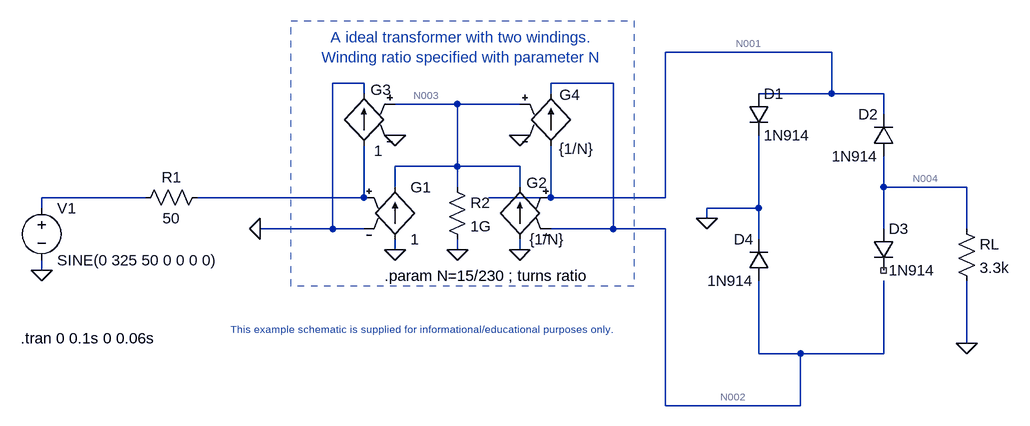
[diagram p0: schematic Full_wave_Rectifier.asc]
Full_wave_Rectifier.asc, the LTspice schematic file:
Version 4
SHEET 1 1160 680
WIRE 880 -192 624 -192
WIRE 160 -144 112 -144
WIRE 544 -144 448 -144
WIRE 160 -128 160 -144
WIRE 448 -128 448 -144
WIRE 880 -128 880 -192
WIRE 880 -128 768 -128
WIRE 960 -128 880 -128
WIRE 304 -112 208 -112
WIRE 400 -112 304 -112
WIRE 960 -96 960 -128
WIRE 304 -16 304 -112
WIRE 304 -16 208 -16
WIRE 400 -16 304 -16
WIRE 208 16 208 -16
WIRE 304 16 304 -16
WIRE 400 16 400 -16
WIRE 960 16 960 -32
WIRE 1088 16 960 16
WIRE -176 32 -336 32
WIRE 160 32 160 -48
WIRE 160 32 -96 32
WIRE 448 32 448 -48
WIRE 448 32 352 32
WIRE 624 32 624 -192
WIRE 624 32 448 32
WIRE -336 48 -336 32
WIRE 768 48 768 -64
WIRE 768 48 688 48
WIRE 688 64 688 48
WIRE 112 80 112 -144
WIRE 112 80 0 80
WIRE 160 80 112 80
WIRE 544 80 544 -144
WIRE 544 80 448 80
WIRE 624 80 544 80
WIRE 960 80 960 16
WIRE 1088 80 1088 16
WIRE 768 96 768 48
WIRE 208 112 208 96
WIRE 304 112 304 96
WIRE 400 112 400 96
WIRE -336 144 -336 128
WIRE 1088 256 1088 160
WIRE 768 272 768 160
WIRE 832 272 768 272
WIRE 960 272 960 160
WIRE 960 272 832 272
WIRE 624 352 624 80
WIRE 832 352 832 272
WIRE 832 352 624 352
FLAG -336 144 0
FLAG 400 112 0
FLAG 208 112 0
FLAG 208 -64 0
FLAG 400 -64 0
FLAG 304 112 0
FLAG 0 80 0
FLAG 688 64 0
FLAG 1088 256 0
SYMBOL voltage -336 32 R0
WINDOW 123 0 0 Left 0
WINDOW 39 0 0 Left 0
SYMATTR InstName V1
SYMATTR Value SINE(0 325 50 0 0 0 0)
SYMBOL res -80 16 R90
WINDOW 0 0 56 VBottom 2
WINDOW 3 32 56 VTop 2
SYMATTR InstName R1
SYMATTR Value 50
SYMBOL g 208 0 R0
SYMATTR InstName G1
SYMATTR Value 1
SYMBOL g 400 0 M0
WINDOW 0 -10 9 Right 2
WINDOW 3 -15 96 Right 2
SYMATTR InstName G2
SYMATTR Value {1/N}
SYMBOL g 160 -144 M0
WINDOW 0 -10 10 Right 2
WINDOW 3 -16 104 Right 2
SYMATTR InstName G3
SYMATTR Value 1
SYMBOL g 448 -144 R0
WINDOW 0 13 18 Left 2
WINDOW 3 12 101 Left 2
SYMATTR InstName G4
SYMATTR Value {1/N}
SYMBOL res 288 0 R0
SYMATTR InstName R2
SYMATTR Value 1G
SYMBOL diode 752 -128 R0
SYMATTR InstName D1
SYMATTR Value 1N914
SYMBOL diode 976 -32 R180
WINDOW 0 24 64 Left 2
WINDOW 3 24 0 Left 2
SYMATTR InstName D2
SYMATTR Value 1N914
SYMBOL diode 944 80 R0
SYMATTR InstName D3
SYMATTR Value 1N914
SYMBOL diode 784 160 R180
WINDOW 0 24 64 Left 2
WINDOW 3 24 0 Left 2
SYMATTR InstName D4
SYMATTR Value 1N914
SYMBOL res 1072 64 R0
SYMATTR InstName RL
SYMATTR Value 3.3k
TEXT 240 224 Top 1 ;This example schematic is supplied for informational/educational purposes only.
TEXT 312 -168 Bottom 2 ;A ideal transformer with two windings.\nWinding ratio specified with parameter N
TEXT 192 152 Left 2 !.param N=15/230 ; turns ratio
TEXT -368 248 Left 2 !.tran 0 0.1s 0 0.06s
RECTANGLE Normal 576 168 48 -240 2

The netlist it stands for:
* Full_wave_Rectifier.asc
V1 N005 0 SINE(0 325 50 0 0 0 0)
R1 N006 N005 50
G1 0 N003 N006 0 1
G2 0 N003 N001 N002 {1/N}
G3 N006 0 N003 0 1
G4 N001 N002 N003 0 {1/N}
R2 N003 0 1G
D1 N001 0 1N914
D2 N004 N001 1N914
D3 N004 NC_01 1N914
D4 N002 0 1N914
RL N004 0 3.3k
.model D D
.lib standard.dio
* This example schematic is supplied for informational/educational purposes only.
* A ideal transformer with two windings.
* Winding ratio specified with parameter N
.param N=15/230 ; turns ratio
.tran 0 0.1s 0 0.06s
.backanno
.end

* Results of the author's LTspice run, read from the files saved beside the schematic
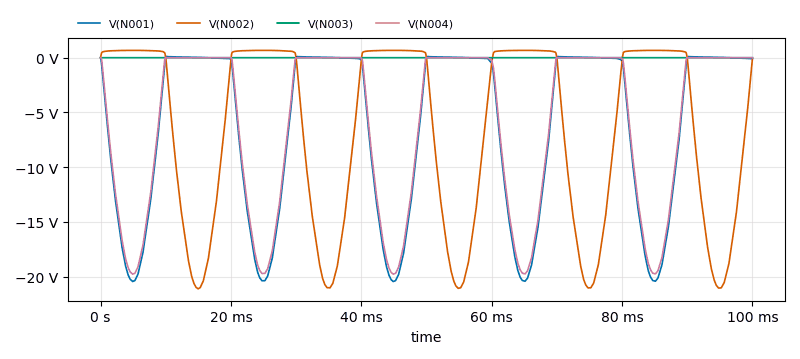
[diagram p1: Transient Analysis of Full_wave_Rectifier.asc, plotted from the saved traces]
* Transient Analysis, 1 run:
*   V(N001): min -20.45 V, max 102.6 mV, average -6.3 V, rms 10.05 V, last -92.69 mV
*   V(N002): min -21.12 V, max 668.7 mV, average -6.27 V, rms 10.46 V, last -92.69 mV
*   V(N003): min -1.586 nV, max 391 µV, average 118.5 µV, rms 190.6 µV, last 1.539 nV
*   V(N004): min -19.78 V, max 27.73 µV, average -5.996 V, rms 9.642 V, last -67.23 µV